# Altium schematic sheet USB.SchDoc: USB
size A4; Date: 2016-06-28; Author: Vitali Tsiukala; DrawnBy: Vitali Tsiukala; Engineer: Vitali Tsiukala; Organization: Trenz Electronic GmbH; DocumentNumber: TE0706; Revision: 02; SheetNumber: 8; SheetTotal: 10
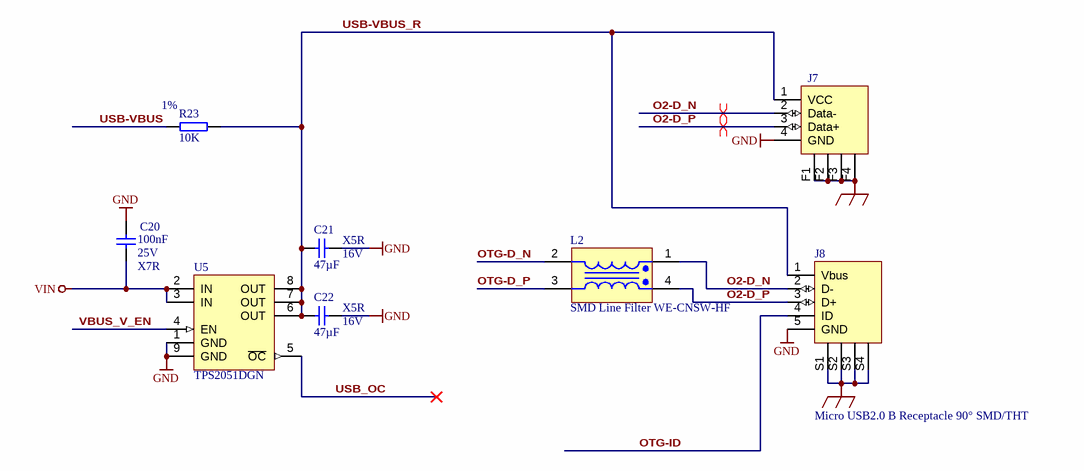
[diagram p0: USB.SchDoc]

## Parts
C20  100nF  Voltage: 25V  Technology: X7R  [CAPC1005X55N]
C21  47µF  Voltage: 16V  Technology: X5R  [CAPC3216X180N]
C22  47µF  Voltage: 16V  Technology: X5R  [CAPC3216X180N]
J7  USB A Buchse 90°  [73725-0110BLF]  (value not drawn)
J8  Micro USB2.0 B Receptacle 90° SMD/THT  [629105150521]
L2  SMD Line Filter WE-CNSW-HF  [WE-CNSW-HF]
R23  10K  Tolerance: 1%  [RESC1005X40N]
U5  TPS2051DGN  [SOP65P488X107-9N-TI]

## Nets
FGND: J7.F1(Frame) J7.F2(Frame) J7.F3(Frame) J7.F4(Frame) J8.S1 J8.S2 J8.S3 J8.S4
GND: C20.2 C21.2 C22.2 J7.4(GND) J8.5(GND) U5.1(GND) U5.9(GND)
VIN: C20.1 U5.2(IN) U5.3(IN)
O2-D_N: J7.2(Data-) J8.2(D-) L2.1
O2-D_P: J7.3(Data+) J8.3(D+) L2.4
OTG-D_N: L2.2
OTG-D_P: L2.3
OTG-ID: J8.4(ID)
USB-VBUS: R23.1
USB-VBUS_R: C21.1 C22.1 J7.1(VCC) J8.1(Vbus) R23.2 U5.6(OUT) U5.7(OUT) U5.8(OUT)
USB_OC: U5.5(~{OC})
VBUS_V_EN: U5.4(EN)

## Layout directives
differential pair: O2-D_N, O2-D_P

## Notes on the sheet
- Title:
- Number:
- Rev.
- Date:
- A4
- Copyright:
- Page
- of
- Filename:

## Library data of the parts
C20 = 22472: KON 100nF 25V X5R SMD; AN: 22472; Value: 100n; Mixed: SMT; Preferred: Yes; Case: 1005 (0402)
C21 C22 = 24955: KON 47µF 16V  X5R SMD 20%; AN: 24955; Value: 47u; Mixed: SMT; Preferred: Yes; Case: 3216 (1206); Tolerance: 20%
J7 = 24948: AN: 24948; Trenz-Stock: Yes; Mixed: THT; HelpURL: B:\AD\adlib\datasheet\73725; H-ART: 73725-0110BLF
J8 = 27235: AN: 27235; Mixed: SMT; HelpURL: ‪B:\AD\adlib\datasheet\629105150521; H-ART: 629105150521
L2 = 24514: Stromkompensierter SMD Line Filter HF 320mA 0,24Ohm 50V; AN: 24514; Trenz-Stock: Yes; Mixed: SMT; H-ART: 744233670; HelpURL: B:\AD\adlib\datasheet\WE-CNSW HF; Voltage: 320mA; Technology: 0.24Ohm; Preferred: Yes
R23 = 22750: WID SMD 10K 1% 0,063W; AN: 22750; Mixed: SMT; Preferred: Yes; Case: 1005 (0402); Value: 10K; Technology: TK100
U5 = 25167: TPS2051BDGN; AN: 25167; Trenz-Stock: Yes; Mixed: SMT; HelpURL: B:\AD\adlib\datasheet\TPS2051BDGN; Preferred: Yes; H-ART: TPS2051BDGN